# EAGLE design optoserial (EAGLE 6.5.0)
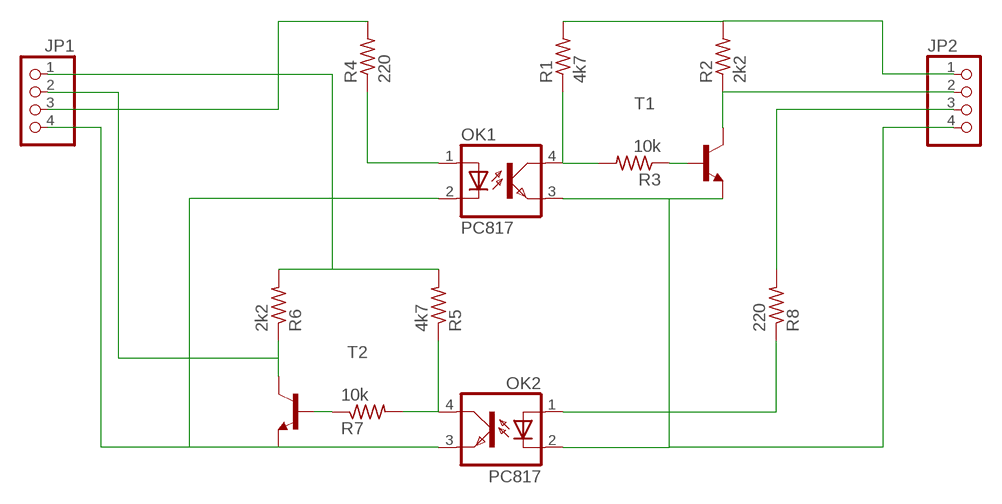
[diagram p0: schematic, sheet 1]

## Parts
JP1  PINHD-1X4  [1X04]
JP2  PINHD-1X4  [1X04]
OK1  PC817  [DIL04]
OK2  PC817  [DIL04]
R1  4k7  R-US_0207/10  [0207/10]
R2  2k2  R-US_0207/10  [0207/10]
R3  10k  R-US_0207/10  [0207/10]
R4  220  R-US_0207/10  [0207/10]
R5  4k7  R-US_0207/10  [0207/10]
R6  2k2  R-US_0207/10  [0207/10]
R7  10k  R-US_0207/10  [0207/10]
R8  220  R-US_0207/10  [0207/10]
T1  2N2222-NPN-TO92-EBC  [TO92-EBC]
T2  2N2222-NPN-TO92-EBC  [TO92-EBC]

## Nets
N$1: JP2.1 R1.2 R2.2
N$2: OK1.4(COL) R1.1 R3.2
N$3: JP2.4 OK1.3(EMIT) OK2.2(C) T1.E
N$4: R3.1 T1.B
N$5: JP2.2 R2.1 T1.C
N$6: OK1.1(A) R4.1
N$7: JP1.1 R5.2 R6.2
N$8: OK2.4(COL) R5.1 R7.2
N$9: JP1.4 OK1.2(C) OK2.3(EMIT) T2.E
N$10: R7.1 T2.B
N$11: JP1.2 R6.1 T2.C
N$12: OK2.1(A) R8.1
N$13: JP1.3 R4.2
N$16: JP2.3 R8.2

## Library data of the parts
JP1 JP2 = pinhead:PINHD-1X4: PIN HEADER
OK1 OK2 = optocoupler:PC817: SHARP OPTO COUPLER; MPN: PC817X4J000F; OC_FARNELL: 9707727; OC_NEWARK: 97K7059
R1-R8 = rcl:R-US_: RESISTOR, American symbol
T1 T2 = transistor-neu-to92:*-NPN-: NPN Transistror

## Board
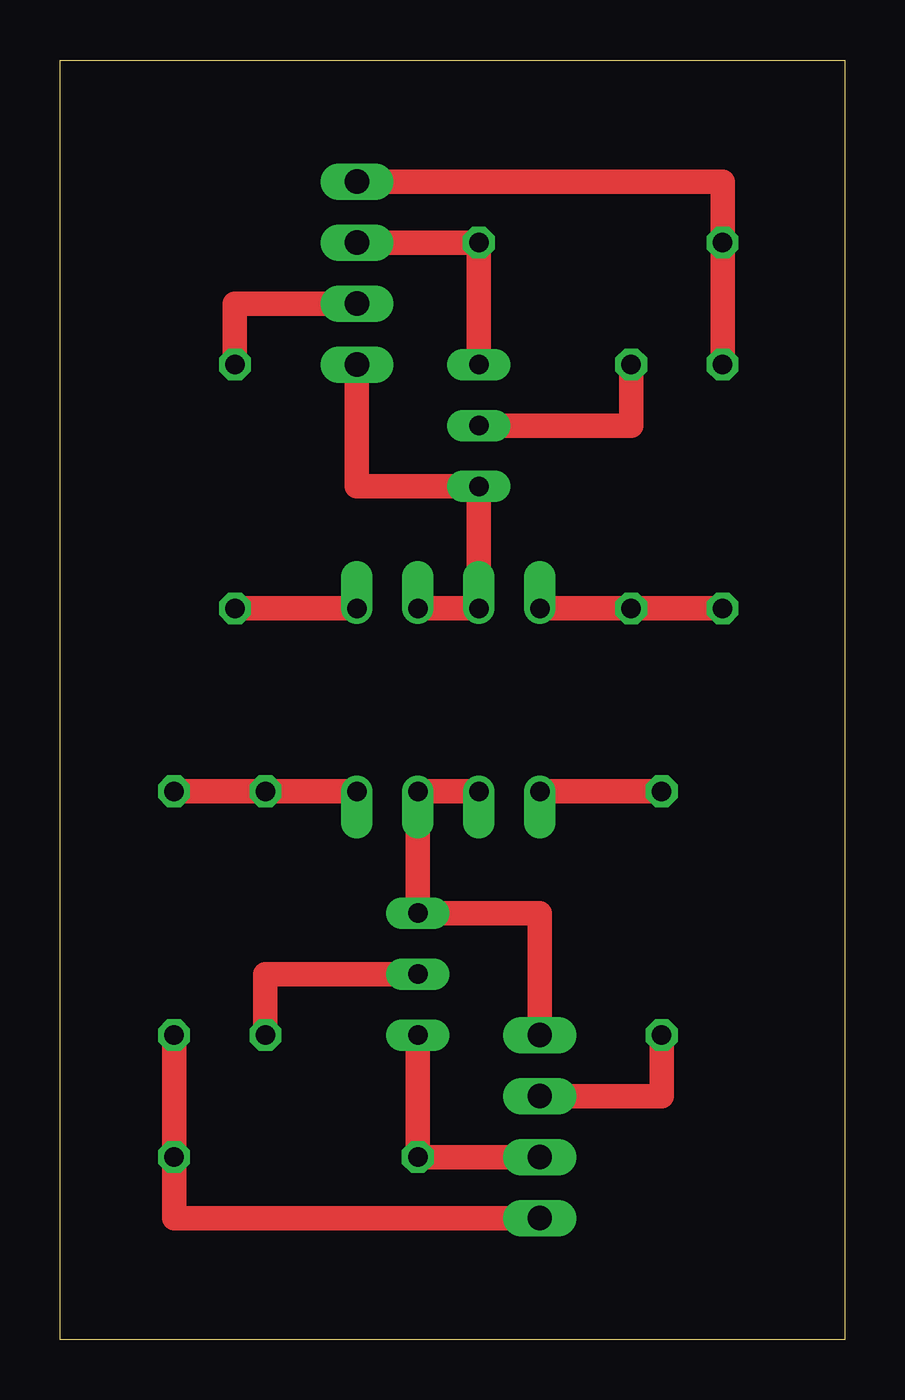
[diagram p1: board, top side]
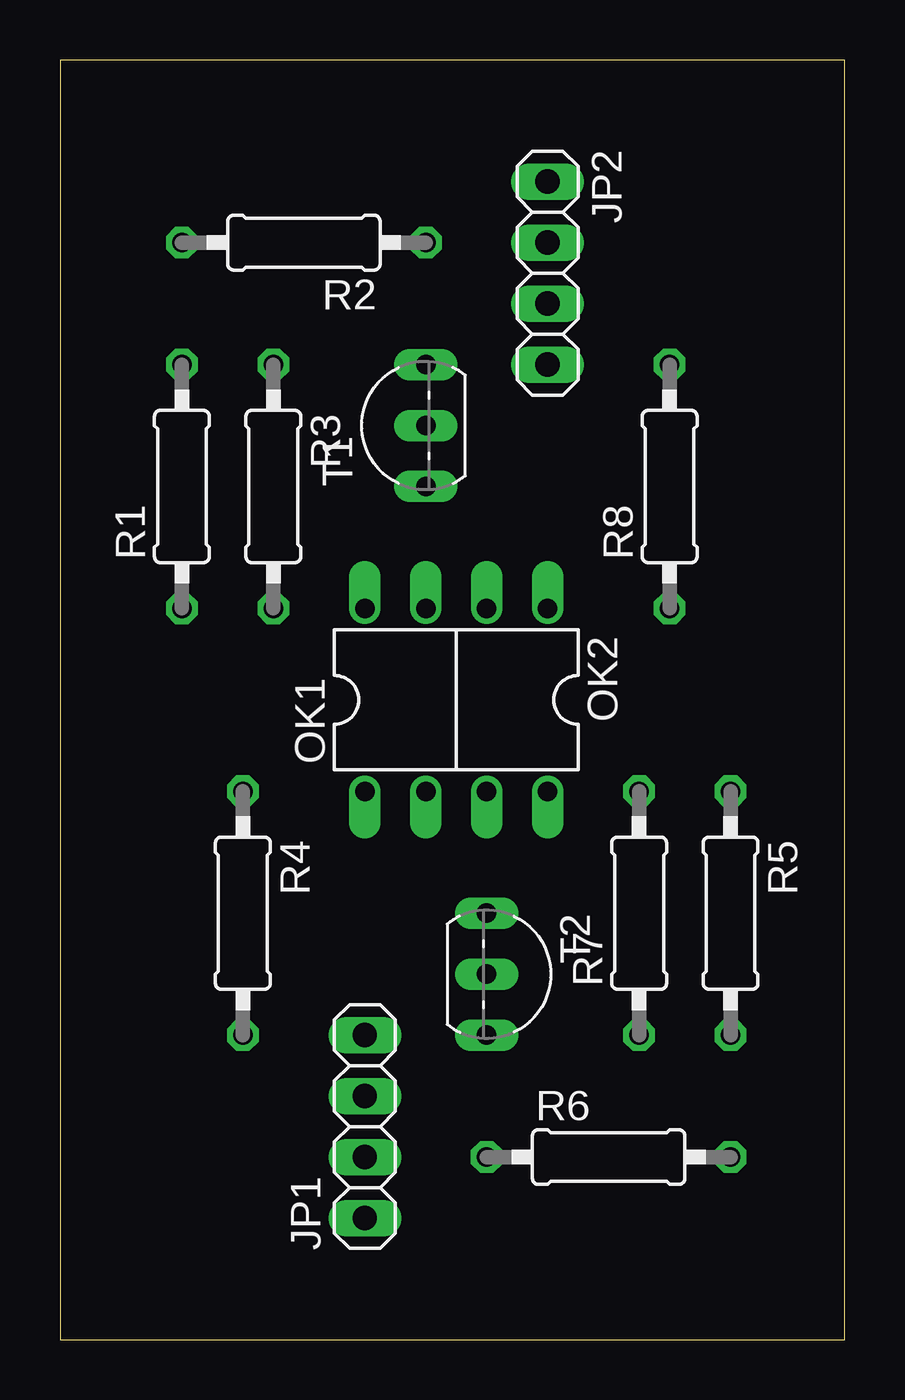
[diagram p2: board, bottom side, seen from below]

Size 32.69 x 53.33 mm. Coordinates in mm from the lower left corner, seen from the top.
Outline: 32.69,0 0,0 0,53.33 32.69,53.33 32.69,0
Copper layers (1*16): Top 0.035mm / dielectric 1.5mm / Bottom 0.035mm
Design rules "default": minimum track width 10mil, minimum drill 24mil, track to track 8mil, track to pad 8mil, pad to pad 8mil, via to via 8mil, smd to smd 8mil, copper to edge 40mil, drill to drill 8mil, minimum pad ring 10mil, minimum via ring 8mil, stop-mask expansion 4mil, vias tented up to drill 0mil, thermal gap 10mil

### Footprints (pad centres in the part's own frame; a part is rotated, then mirrored left to right if it is on the bottom)
1X04 = drill 1.016 long: 1 -3.81,0; 2 -1.27,0; 3 1.27,0; 4 3.81,0
DIL04 = drill 0.813 offset: 1 -1.27,-3.81; 2 1.27,-3.81; 3 1.27,3.81; 4 -1.27,3.81
0207/10 = drill 0.813 octagon: 1 -5.08,0; 2 5.08,0
TO92-EBC = drill 0.813 long: B 0,-1.27; C 2.54,-1.27; E -2.54,-1.27

### Placement (x,y rotation side)
JP1  19.99,8.89 90 bottom
JP2  12.37,44.45 270 bottom
OK1  18.72,26.67 0 bottom
OK2  13.64,26.67 180 bottom
R1  27.61,35.56 90 bottom
R2  22.53,45.72 180 bottom
R3  23.8,35.56 270 bottom
R4  25.07,17.78 270 bottom
R5  4.75,17.78 270 bottom
R6  9.83,7.62 0 bottom
R7  8.56,17.78 90 bottom
R8  7.29,35.56 90 bottom
T1  18.72,38.1 90 bottom
T2  13.64,15.24 270 bottom

### Tracks (layer width: path | path; a pad name or v marks a point on that pad's centre or on a via)
N$1
  Top 1.016: R1.2 R2.2 27.61,48.26 JP2.1
N$2
  Top 1.016: OK1.4 R3.2 R1.1
N$3
  Top 1.016: OK2.2 OK1.3 T1.E 12.37,35.56 JP2.4
N$4
  Top 1.016: T1.B 23.8,38.1 R3.1
N$5
  Top 1.016: T1.C R2.1 JP2.2
N$6
  Top 1.016: R4.1 OK1.1
N$7
  Top 1.016: R5.2 R6.2 4.75,5.08 JP1.1
N$8
  Top 1.016: OK2.4 R7.2 R5.1
N$9
  Top 1.016: OK1.2 OK2.3 T2.E 19.99,17.78 JP1.4
N$10
  Top 1.016: T2.B 8.56,15.24 R7.1
N$11
  Top 1.016: T2.C R6.1 JP1.2
N$12
  Top 1.016: OK2.1 R8.1
N$13
  Top 1.016: R4.2 25.07,10.16 JP1.3
N$16
  Top 1.016: JP2.3 7.29,43.18 R8.2